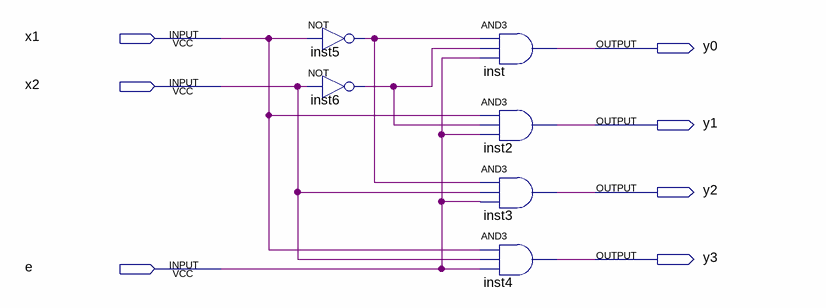
[diagram p0: schematic sheet]
// Quartus schematic Decoder2x4.bdf as structural Verilog: 6 symbols, 7 pins
module Decoder2x4 (
  input  x1,
  input  x2,
  input  e,
  output y0,
  output y1,
  output y2,
  output y3
);

  wire inst5_out, inst6_out;

  not inst5 (inst5_out, x1);
  not inst6 (inst6_out, x2);
  and inst (y0, inst5_out, inst6_out, e);
  and inst2 (y1, x1, inst6_out, e);
  and inst3 (y2, inst5_out, x2, e);
  and inst4 (y3, x1, x2, e);
endmodule
